# Altium schematic sheet 1_dif_comp_stage.SchDoc
size A4; SheetNumber: 5; SheetTotal: 5
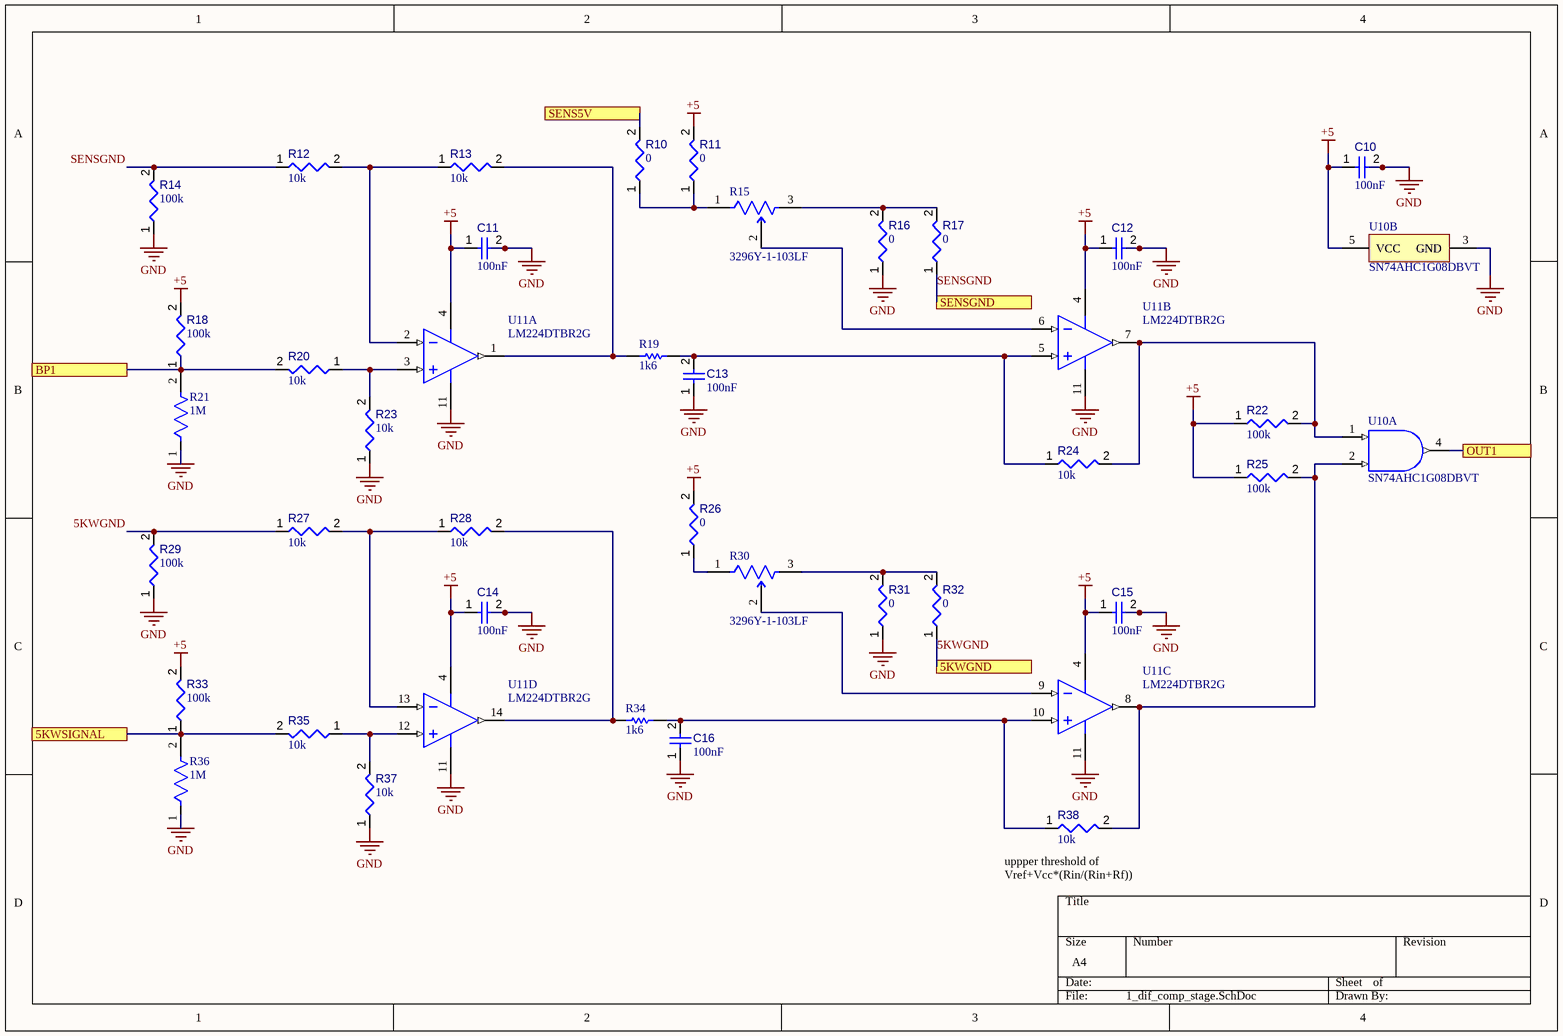
[diagram p0: 1_dif_comp_stage.SchDoc]

## Parts
C10  value 100nF  [CAPC1608X90X40NL10T20]  (hidden comment: Capacitor 100 nF +/-10% 50 V 0603)
C11  value 100nF  [CAPC1608X90X40NL10T20]  (hidden comment: Capacitor 100 nF +/-10% 50 V 0603)
C12  value 100nF  [CAPC1608X90X40NL10T20]  (hidden comment: Capacitor 100 nF +/-10% 50 V 0603)
C13  value 100nF  [CAPC1608X90X40NL10T20]  (hidden comment: Capacitor 100 nF +/-10% 50 V 0603)
C14  value 100nF  [CAPC1608X90X40NL10T20]  (hidden comment: Capacitor 100 nF +/-10% 50 V 0603)
C15  value 100nF  [CAPC1608X90X40NL10T20]  (hidden comment: Capacitor 100 nF +/-10% 50 V 0603)
C16  value 100nF  [CAPC1608X90X40NL10T20]  (hidden comment: Capacitor 100 nF +/-10% 50 V 0603)
R10  value 0  [RESC0603(1608)_L]  (hidden comment: 0R3J)
R11  value 0  [RESC0603(1608)_L]  (hidden comment: 0R3J)
R12  value 10k  [RESC1608X55X25ML10T15]  (hidden comment: Resistor 10k +/-1% 0603 100 mW)
R13  value 10k  [RESC1608X55X25ML10T15]  (hidden comment: Resistor 10k +/-1% 0603 100 mW)
R14  value 100k  [RESC1608X55X25ML10T15]  (hidden comment: Resistor 100k +/-1% 0603 100 mW)
R15  3296Y-1-103LF  [FP-3296Y-MFG]
R16  value 0  [RESC0603(1608)_L]  (hidden comment: 0R3J)
R17  value 0  [RESC0603(1608)_L]  (hidden comment: 0R3J)
R18  value 100k  [RESC1608X55X25ML10T15]  (hidden comment: Resistor 100k +/-1% 0603 100 mW)
R19  1k6  [RESC1609X50X30LL10T20]
R20  value 10k  [RESC1608X55X25ML10T15]  (hidden comment: Resistor 10k +/-1% 0603 100 mW)
R21  1M  [FP-RMCF0603-IPC_B]
R22  value 100k  [RESC1608X55X25ML10T15]  (hidden comment: Resistor 100k +/-1% 0603 100 mW)
R23  value 10k  [RESC1608X55X25ML10T15]  (hidden comment: Resistor 10k +/-1% 0603 100 mW)
R24  value 10k  [RESC1608X55X25ML10T15]  (hidden comment: Resistor 10k +/-1% 0603 100 mW)
R25  value 100k  [RESC1608X55X25ML10T15]  (hidden comment: Resistor 100k +/-1% 0603 100 mW)
R26  value 0  [RESC0603(1608)_L]  (hidden comment: 0R3J)
R27  value 10k  [RESC1608X55X25ML10T15]  (hidden comment: Resistor 10k +/-1% 0603 100 mW)
R28  value 10k  [RESC1608X55X25ML10T15]  (hidden comment: Resistor 10k +/-1% 0603 100 mW)
R29  value 100k  [RESC1608X55X25ML10T15]  (hidden comment: Resistor 100k +/-1% 0603 100 mW)
R30  3296Y-1-103LF  [FP-3296Y-MFG]
R31  value 0  [RESC0603(1608)_L]  (hidden comment: 0R3J)
R32  value 0  [RESC0603(1608)_L]  (hidden comment: 0R3J)
R33  value 100k  [RESC1608X55X25ML10T15]  (hidden comment: Resistor 100k +/-1% 0603 100 mW)
R34  1k6  [RESC1609X50X30LL10T20]
R35  value 10k  [RESC1608X55X25ML10T15]  (hidden comment: Resistor 10k +/-1% 0603 100 mW)
R36  1M  [FP-RMCF0603-IPC_B]
R37  value 10k  [RESC1608X55X25ML10T15]  (hidden comment: Resistor 10k +/-1% 0603 100 mW)
R38  value 10k  [RESC1608X55X25ML10T15]  (hidden comment: Resistor 10k +/-1% 0603 100 mW)
U10  SN74AHC1G08DBVT  [DBV0005A_L]  (parts A,B of 2)
U11  LM224DTBR2G  [ONSC-TSSOP-14-948G-01_V]  (parts A,B,C,D of 4)

## Ports
5KWGND, 5KWSIGNAL, BP1, OUT1, SENS5V, SENSGND

## Nets
+5: C10.1 C11.1 C12.1 C14.1 C15.1 R11.2 R18.2 R22.1 R25.1 R26.2 R33.2 U10.5(VCC) U11.4(VCC)
GND: C10.2 C11.2 C12.2 C13.1 C14.2 C15.2 C16.1 R14.1 R16.1 R21.1 R23.1 R29.1 R31.1 R36.1 R37.1 U10.3(GND) U11.11(VEE/GND)
5KWGND: R27.1 R29.2 R32.1 ; port 5KWGND
5KWSIGNAL: R33.1 R35.2 R36.2 ; port 5KWSIGNAL
BP1: R18.1 R20.2 R21.2 ; port BP1
OUT1: U10.4(Y) ; port OUT1
SENS5V: R10.2 ; port SENS5V
SENSGND: R12.1 R14.2 R17.1 ; port SENSGND
NetC13_2: C13.2 R19.2 R24.1 U11.5(IN2+)
NetC16_2: C16.2 R34.2 R38.1 U11.10(IN3+)
NetR10_1: R10.1 R11.1 R15.1(CCW)
NetR12_2: R12.2 R13.1 U11.2(IN1-)
NetR13_2: R13.2 R19.1 U11.1(OUT1)
NetR15_2: R15.2(WIPER) U11.6(IN2-)
NetR15_3: R15.3(CW) R16.2 R17.2
NetR20_1: R20.1 R23.2 U11.3(IN1+)
NetR22_2: R22.2 R24.2 U10.1(A) U11.7(OUT2)
NetR25_2: R25.2 R38.2 U10.2(B) U11.8(OUT3)
NetR26_1: R26.1 R30.1(CCW)
NetR27_2: R27.2 R28.1 U11.13(IN4-)
NetR28_2: R28.2 R34.1 U11.14(OUT4)
NetR30_2: R30.2(WIPER) U11.9(IN3-)
NetR30_3: R30.3(CW) R31.2 R32.2
NetR35_1: R35.1 R37.2 U11.12(IN4+)

## Notes on the sheet
- (near R38) uppper threshold of Vref+Vcc*(Rin/(Rin+Rf))

## Library data of the parts
C10-C16 = CMP-001-00017-6: Chip Capacitor, 100 nF, +/- 10%, 50 V, 0603 (1608 Metric); Voltage Rating: 50V; Capacitor Type: Ceramic; Tolerance: 10%; Mounting Technology: SM; Max Operating Temperature: 125°C; RoHS Compliant: True; Pins: 2; Case/Package: 0603; Min Operating Temperature: -55°C
R10 R11 R16 R17 R26 R31 R32 = CMP-009-00063-2: Jumper 0603 (1608 Metric); Case/Package: 0603; Mounting Technology: SMT; Pins: 2
R12 R13 R20 R23 R24 R27 R28 R35 R37 R38 = CMP-009-00017-5: Chip Resistor, 10 KOhm, +/- 1%, 01 W, -55 to 155 degC, 0603 (1608 Metric); Voltage Rating: 50V; Power: 100mW; RoHS Compliant: True; Min Operating Temperature: -55°C; Pins: 2; Case/Package: 0603; Mounting Technology: SM; Max Operating Temperature: 155°C; Tolerance: 1%
R14 R18 R22 R25 R29 R33 = CMP-009-00023-5: Chip Resistor, 100 KOhm, +/- 1%, 0.1 W, -55 to 155 degC, 0603 (1608 Metric); Voltage Rating: 50V; Power: 100mW; Max Operating Temperature: 155°C; RoHS Compliant: True; Tolerance: 1%; Pins: 2; Case/Package: 0603; Mounting Technology: SM; Min Operating Temperature: -55°C
R15 R30 = CMP-07234-000015-2: TRIMMER 10K OHM 0.5W PC PIN TOP; Manufacturer Series: 3296; Resistance: 10kR; Actuator Orientation: Vertical; Power Rating: 500mW; Temperature Coefficient: 100ppm/°C; Resistance Tolerance: 10%; Resistance Law: Linear; Number of Turns: 25; Actuator Type: SCREW; Number of Terminals/Pins: 3; Insulation Resistance: 1GR; Military Standard: Not; REACH SVHC: No SVHC; Lead Free: Lead Free; Resistor Type: Cermet; Max Operating Temperature: 125°C; Radiation Hardening: No; Package Quantity: 50; Mount: Panel; Max Power Dissipation: 500mW; Min Operating Temperature: -55°C; Type: Potentiometer; Terminal Finish: Tin; Termination: Pin; Taper: Linear; Color: Blue; Technology: CERMET; Packaging: Rail/Tube; Weight: 0.03oz; Height: 0.395inch; Number of Pins: 3; RoHS Compliant: Yes; Width: 9.53mm; Tolerance: 10%; Depth: 4.83mm; Series: 3296; Length: 9.53mm
R19 R34 = CMP-2000-03000-1: Part Number: CRCW06031K60FKEA; Manufacturer: Vishay Dale
R21 R36 = CMP-26527-006958-1: 1MΩ ±1% 0.1W 0603 Thick Film Chip Resistor AEC-Q200 compliant; Resistance: 1MR; Working Voltage: 75V; Temperature Coefficient: 100ppm/°C; Power Rating: 100mW; Series: RMCF; Case/Package: 0603; Packaging: Tape and Reel; Technology: THICK FILM; Depth: 0.8mm; Contact Plating: Tin; Lead Free: Lead Free; Mount: Surface Mount; Features: Automotive AEC-Q200; Construction: Rectangular; Length: 1.55mm; Tolerance: 1%; Resistor Type: Thick Film; Max Power Dissipation: 100mW; Case Code (Imperial): 0603; Height: 0.022inch; Max Operating Temperature: 155°C; Radiation Hardening: No; Width: 0.031inch; Min Operating Temperature: -55°C; Military Standard: Not; Number of Terminations: 2; Case Code (Metric): 1608; RoHS Compliant: Yes
U10 = CMP-0859-00047-3: Single 2-Input Positive-AND Gate, DBV0005A, SMALL T&R; Manufacturer: Texas Instruments; ICC @ Nom Voltage(Max)(mA): 0.01; Rating: Catalog; Output Drive (IOL/IOH)(Max)(mA): 50/-50; F @ Nom Voltage(Max)(Mhz): 75; Technology Family: AHC; VCC(Max)(V): 5.5; Voltage(Nom)(V): 3.3,5; Logic: True; Input Type: CMOS; tpd @ Nom Voltage(Max)(ns): 12.3,7.9; Bits(#): 1; Gate Type: AND; Schmitt Trigger: No; VCC(Min)(V): 2; Operating Temperature Range(C): -55 to 125; Sub-Family: AND Gate; Generic Part Number: SN74AHC1G08; PackageReference: DBV0005A; DatasheetVersion: SCLS314N; Output Type: CMOS; 3-State Output: No
U11 = CMP-1310-00430-1: Single Supply Quad Operational Amplifier, 3 to 32 V, -25 to 85 degC, 14-Pin TSSOP, Pb-Free, Tape and Reel; Manufacturer: On Semiconductor; VCC Min (V): 3; VCC Max (V): 32; Mounting Technology: Surface Mount; PackageVersion: Rev. B, 10/2006; DatasheetVersion: Rev. 25; RoHS: TRUE; ComponentLink3URL: http://www.onsemi.com/pub_link/Collateral/948G-01.PDF; ComponentLink3Description: Package Specification; PackageDescription: 14-Pin Small Outline Package, Body 5 x 4.4 mm, Pitch 0.65 mm; PackageReference: TSSOP-14-948G-01; ComponentLink1URL: http://www.onsemi.com/; Packing: Tape and Reel; ComponentLink2Description: Datasheet; PartNumber: LM224DTBR2G; ComponentLink2URL: http://www.onsemi.cn/pub_link/Collateral/LM324-D.PDF; ComponentLink1Description: Manufacturer URL